# Altium project ps2-blueretro.PrjPcb
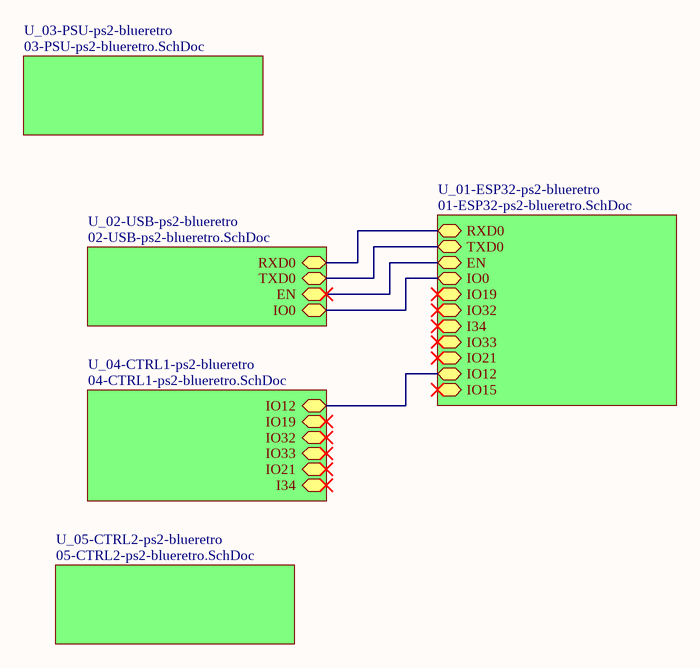
[diagram p0: 00-ps2-blueretro.SchDoc]
6 sheets, 58 parts. Net scope: hierarchical (ports join the sheet entries above them; power ports are global).
Board file: ps2-blueretro.PcbDoc
Sheets:
  00-ps2-blueretro.SchDoc
    U_03-PSU-ps2-blueretro = 03-PSU-ps2-blueretro.SchDoc
    U_01-ESP32-ps2-blueretro = 01-ESP32-ps2-blueretro.SchDoc
    U_02-USB-ps2-blueretro = 02-USB-ps2-blueretro.SchDoc
    U_04-CTRL1-ps2-blueretro = 04-CTRL1-ps2-blueretro.SchDoc
    U_05-CTRL2-ps2-blueretro = 05-CTRL2-ps2-blueretro.SchDoc

## Sheet 00-ps2-blueretro.SchDoc
size A; SheetNumber: 1; SheetTotal: 6

### Sub-sheets
U_01-ESP32-ps2-blueretro = 01-ESP32-ps2-blueretro.SchDoc: RXD0 (bidir), TXD0 (bidir), EN (bidir), IO0 (bidir), IO19 (bidir), IO32 (bidir), I34 (bidir), IO33 (bidir), IO21 (bidir), IO12 (bidir), IO15 (bidir)
U_02-USB-ps2-blueretro = 02-USB-ps2-blueretro.SchDoc: RXD0 (bidir), TXD0 (bidir), EN (bidir), IO0 (bidir)
U_03-PSU-ps2-blueretro = 03-PSU-ps2-blueretro.SchDoc: no entries
U_04-CTRL1-ps2-blueretro = 04-CTRL1-ps2-blueretro.SchDoc: IO19 (bidir), IO32 (bidir), IO33 (bidir), IO21 (bidir), I34 (bidir), IO12 (bidir)
U_05-CTRL2-ps2-blueretro = 05-CTRL2-ps2-blueretro.SchDoc: no entries

### Nets
NetC8_2: sheet U_01-ESP32-ps2-blueretro/EN, sheet U_02-USB-ps2-blueretro/EN
NetQ2_3: sheet U_01-ESP32-ps2-blueretro/IO0, sheet U_02-USB-ps2-blueretro/IO0
NetR8_1: sheet U_01-ESP32-ps2-blueretro/RXD0, sheet U_02-USB-ps2-blueretro/RXD0
NetR9_1: sheet U_01-ESP32-ps2-blueretro/TXD0, sheet U_02-USB-ps2-blueretro/TXD0
NetR18_2: sheet U_01-ESP32-ps2-blueretro/IO12, sheet U_04-CTRL1-ps2-blueretro/IO12

## Sheet 03-PSU-ps2-blueretro.SchDoc
size A; SheetNumber: 4; SheetTotal: 4
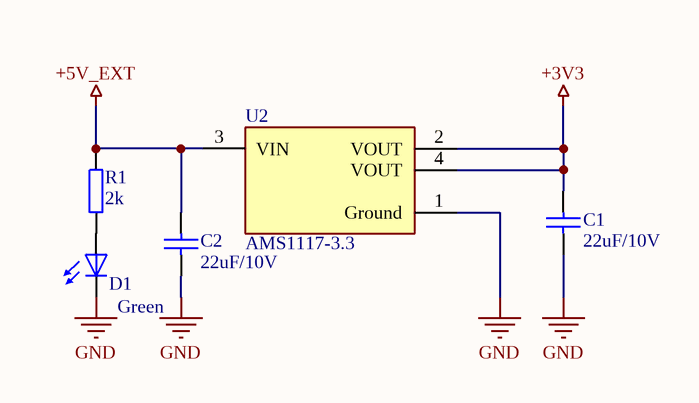
[diagram p1: 03-PSU-ps2-blueretro.SchDoc]

### Parts
C1  value 22uF/10V  [cap_0603]  (hidden comment: cap_0603)
C2  value 22uF/10V  [cap_0603]  (hidden comment: cap_0603)
D1  value Green  [led0603_GREEN]  (hidden comment: led_0603)
R1  value 2k  [res_0603]  (hidden comment: res_0603)
U2  AMS1117-3.3  [FP-AMS1117-IPC_C]

### Nets
+3V3: C1.2 U2.2(VOUT) U2.4(VOUT)
+5V_EXT: C2.2 R1.2 U2.3(VIN)
GND: C1.1 C2.1 D1.2(C) U2.1(Ground)
NetD1_1: D1.1(A) R1.1

### Library data of the parts
D1 = led_0603: Green 3,2V 20mA; Manufacturer: Würth Elektronik; Manufacturer Part Number: 150060GS75000; Supplier: Digikey; Price: 0,14; Supplier Part Number: 732-4971-1-ND; ComponentLink1Description: Supplier Link; ComponentLink1URL: https://www.digikey.at/de/products/detail/w%C3%BCrth-elektronik/150060GS75000/4489898; ComponentLink2Description: Manufacturer Link; ComponentLink2URL: *; ComponentLink3Description: Datasheet Link; ComponentLink3URL: https://www.we-online.com/components/products/datasheet/150060GS75000.pdf
U2 = CMP-209535-000001-1: LDO Voltage Regulators 1A, 3.3V; Manufacturer: Advanced Monolithic Systems; Dropout Voltage: 1.1V; Output Type: Fixed; Nominal Supply Current: 5mA; Max Power Dissipation: 1.2W; Max Supply Voltage: 15V; Number Of Outputs: 1; Standoff Height: 0.64mm; Max Junction Temp: +125°C; Height: 1.8mm; Package: AMS1117; Device Class L2: Power Management ICs; ComponentLink2Description: Datasheet; ComponentLink2URL: http://www.advanced-monolithic.com/pdf/ds1117.pdf; Category: IC; RoHS: TRUE; Automotive: No; Device Class L1: Integrated Circuits (ICs); Output Current: 1A; Device Class L3: Voltage Regulators - Linear; Temperature: -40°C to +125°C; Output Voltage: 3.3V; Manufacturer Part Number: AMS1117-3.3; Temperature Range Low: -40°C; Octopart: https://octopart.com/ams1117-3.3-advanced+monolithic+systems-25899300; Lead Free: Yes; Ipc Land Pattern Name: SOT229P700X180-4; Temperature Range High: +125°C

## Sheet 01-ESP32-ps2-blueretro.SchDoc
size A4; SheetNumber: 2; SheetTotal: 7
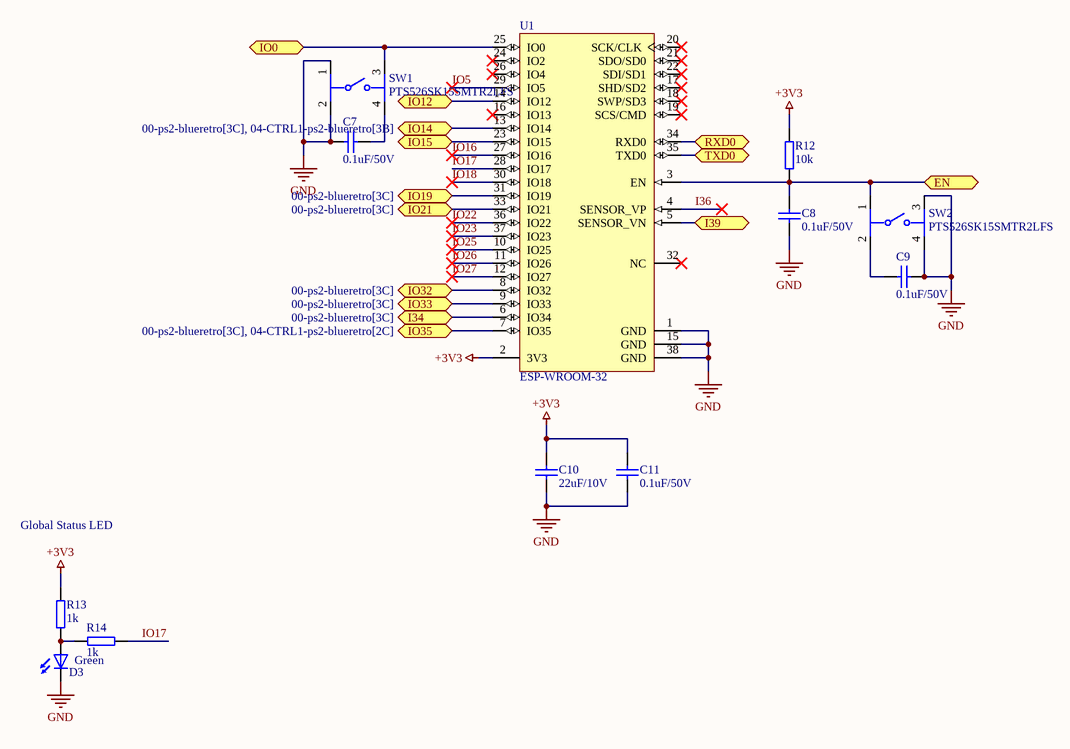
[diagram p2: 01-ESP32-ps2-blueretro.SchDoc]

### Parts
C7  value 0.1uF/50V  [cap_0603]  (hidden comment: cap_0603)
C8  value 0.1uF/50V  [cap_0603]  (hidden comment: cap_0603)
C9  value 0.1uF/50V  [cap_0603]  (hidden comment: cap_0603)
C10  value 22uF/10V  [cap_0603]  (hidden comment: cap_0603)
C11  value 0.1uF/50V  [cap_0603]  (hidden comment: cap_0603)
D3  value Green  [led0603_GREEN]  (hidden comment: led_0603)
R12  value 10k  [res_0603]  (hidden comment: res_0603)
R13  value 1k  [res_0603]  (hidden comment: res_0603)
R14  value 1k  [res_0603]  (hidden comment: res_0603)
SW1  PTS526SK15SMTR2LFS  [FP-PTS526SK15SMTR2LFS-MFG]
SW2  PTS526SK15SMTR2LFS  [FP-PTS526SK15SMTR2LFS-MFG]
U1  ESP-WROOM-32  [OLMX-ESP-WROOM-32]

### Ports
EN (bidir, see 00-ps2-blueretro[3B], 02-USB-ps2-blueretro[4A]), I34 (bidir, see 00-ps2-blueretro[3C]), I39 (bidir), IO0 (bidir, see 00-ps2-blueretro[3C], 02-USB-ps2-blueretro[4B]), IO12 (bidir, see 00-ps2-blueretro[3C], 04-CTRL1-ps2-blueretro[3B]), IO14 (bidir, see 00-ps2-blueretro[3C], 04-CTRL1-ps2-blueretro[3B]), IO15 (bidir, see 00-ps2-blueretro[3C]), IO19 (bidir, see 00-ps2-blueretro[3C]), IO21 (bidir, see 00-ps2-blueretro[3C]), IO32 (bidir, see 00-ps2-blueretro[3C]), IO33 (bidir, see 00-ps2-blueretro[3C]), IO35 (bidir, see 00-ps2-blueretro[3C], 04-CTRL1-ps2-blueretro[2C]), RXD0 (bidir, see 00-ps2-blueretro[3B], 02-USB-ps2-blueretro[4C]), TXD0 (bidir, see 00-ps2-blueretro[3B], 02-USB-ps2-blueretro[4C])

### Nets
+3V3: C10.2 C11.2 R12.1 R13.2 U1.2(3V3)
GND: C7.2 C8.1 C9.2 C10.1 C11.1 D3.2(C) SW1.1 SW1.2 SW2.3 SW2.4 U1.1(GND) U1.15(GND) U1.38(GND)
I36: U1.4(SENSOR_VP)
IO5: U1.29(IO5)
IO16: U1.27(IO16)
IO17: R14.1 U1.28(IO17)
IO18: U1.30(IO18)
IO22: U1.36(IO22)
IO23: U1.37(IO23)
IO25: U1.10(IO25)
IO26: U1.11(IO26)
IO27: U1.12(IO27)
NetC7_1: C7.1 SW1.4
NetC8_2: C8.2 R12.2 SW2.1 U1.3(EN) ; port EN
NetC9_1: C9.1 SW2.2
NetD3_1: D3.1(A) R13.1 R14.2
NetQ2_3: SW1.3 U1.25(IO0) ; port IO0
NetR8_1: U1.34(RXD0) ; port RXD0
NetR9_1: U1.35(TXD0) ; port TXD0
NetR18_2: U1.14(IO12) ; port IO12
NetU1_5: U1.5(SENSOR_VN) ; port I39
NetU1_6: U1.6(IO34) ; port I34
NetU1_7: U1.7(IO35) ; port IO35
NetU1_8: U1.8(IO32) ; port IO32
NetU1_9: U1.9(IO33) ; port IO33
NetU1_13: U1.13(IO14) ; port IO14
NetU1_23: U1.23(IO15) ; port IO15
NetU1_31: U1.31(IO19) ; port IO19
NetU1_33: U1.33(IO21) ; port IO21

Not connected (* = marked no-connect by the designer): U1 16(IO13)* 17(SHD/SD2)* 18(SWP/SD3)* 19(SCS/CMD)* 20(SCK/CLK)* 21(SDO/SD0)* 22(SDI/SD1)* 24(IO2)* 26(IO4)* 32(NC)*

### Notes on the sheet
- Global Status LED

### Library data of the parts
D3 = led_0603: as D1 on sheet 03-PSU-ps2-blueretro; Supplier: Digikey; Price: 0,14; Supplier Part Number: 732-4971-1-ND; ComponentLink1Description: Supplier Link; ComponentLink1URL: https://www.digikey.at/de/products/detail/w%C3%BCrth-elektronik/150060GS75000/4489898; ComponentLink2Description: Manufacturer Link; ComponentLink2URL: *; ComponentLink3Description: Datasheet Link; ComponentLink3URL: https://www.we-online.com/components/products/datasheet/150060GS75000.pdf
SW1 SW2 = CMP-10040-000013-1: TACT 5.2 X 5.2, 1.5 MM H, 260GF,; Manufacturer: C&K; Operating Force: 250gf; Throw Configuration: SPST-NO; Contact Current Rating: 50mA; Standoff Height: 0mm; Contact Resistance: 100mΩ; Voltage Rating Dc: 12V; Electromechanical Life: 200000Cycles; Device Class L3: Tactile Switches; Device Class L2: Switches; Temperature: -20°C to +70°C; Temperature Range Low: -20°C; Package: PTS526SK15SMTR2LFS; Temperature Range High: +70°C; ComponentLink2Description: Datasheet; Device Class L1: Electromechanical; Height: 1.65mm; Digikey Description: TACT 5.2 X 5.2, 1.5 MM H, 260GF,; Category: Switch; RoHS: TRUE; Automotive: No; Lead Free: Yes; Manufacturer Part Number: PTS526SK15SMTR2LFS; Octopart: https://octopart.com/pts526+sk15+smtr2+lfs-c%26k+components-100617999; ComponentLink2URL: https://www.ckswitches.com/media/2780/pts526.pdf
U1 = CMP-2000-07454-1: Espressif System, 2.7 to 3.6 V, -40 to 85 degC, 38-Pin SMD; Manufacturer: Olimex; Package Description: 38-Pin Surface Mount Device, Body 18 x 25.5 mm, Pitch 1.27 mm; Manufacturer URL: https://www.olimex.com; RoHSCompliant: false; Mounting Technology: SurfaceMount; Datasheet Version: Rev. 2.1, 09/2017; Datasheet URL: http://www.espressif.com/sites/default/files/documentation/esp-wroom-32_datasheet_en.pdf; Package Reference: ESP-WROOM-32

## Sheet 02-USB-ps2-blueretro.SchDoc
size A; SheetNumber: 3; SheetTotal: 4
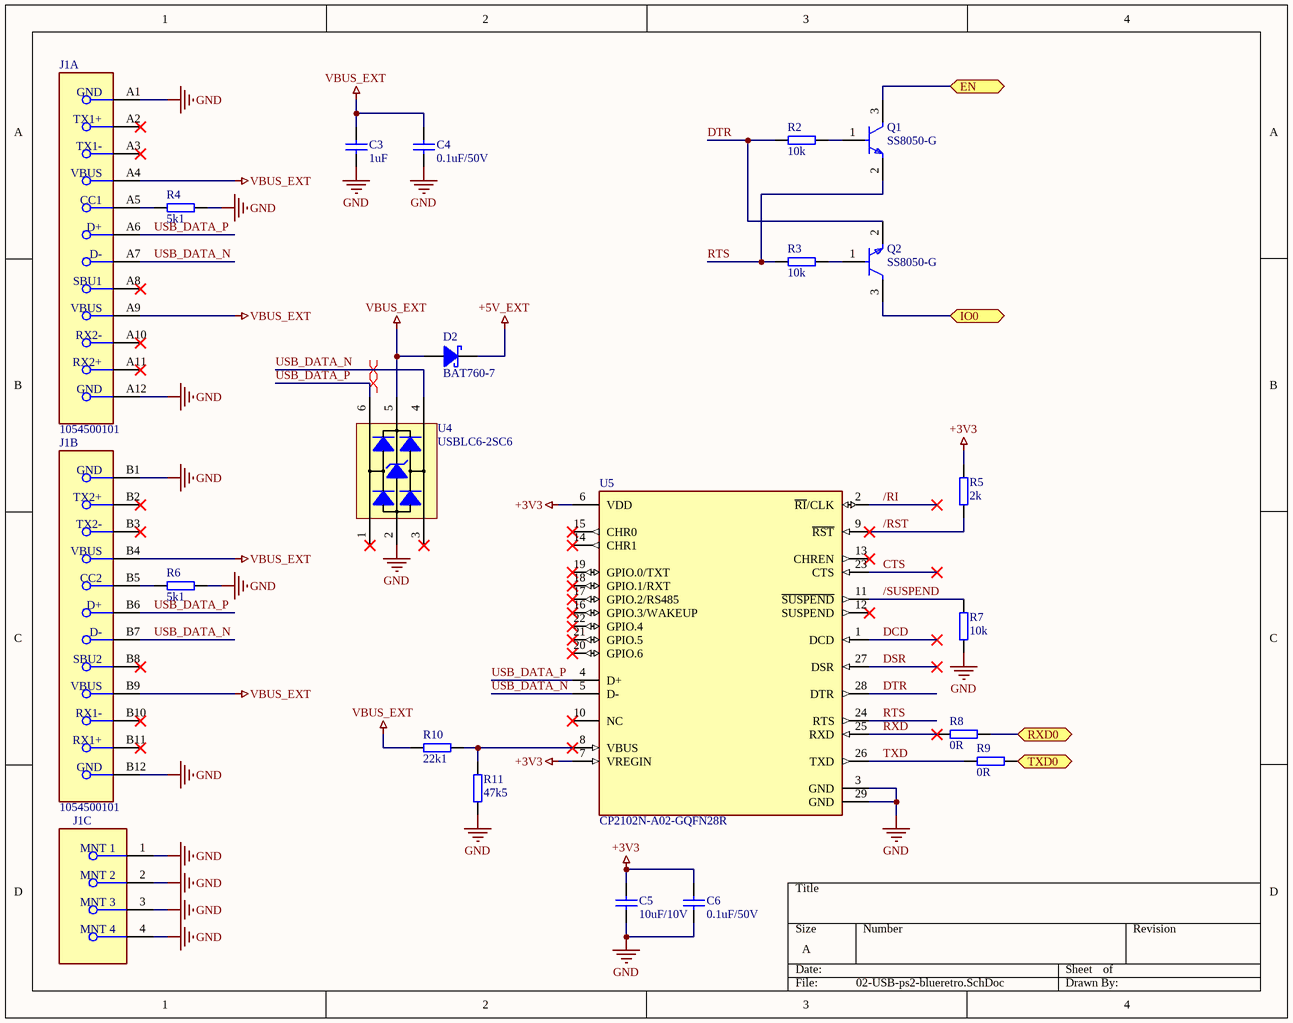
[diagram p3: 02-USB-ps2-blueretro.SchDoc]

### Parts
C3  value 1uF  [cap_0603]  (hidden comment: cap_0603)
C4  value 0.1uF/50V  [cap_0603]  (hidden comment: cap_0603)
C5  value 10uF/10V  [cap_0603]  (hidden comment: cap_0603)
C6  value 0.1uF/50V  [cap_0603]  (hidden comment: cap_0603)
D2  BAT760-7  [sod-323]
J1  1054500101  [FP-1054500101-MFG]  (parts A,B,C of 3)
Q1  SS8050-G  [FP-SS8050-G-MFG]
Q2  SS8050-G  [FP-SS8050-G-MFG]
R2  value 10k  [res_0603]  (hidden comment: res_0603)
R3  value 10k  [res_0603]  (hidden comment: res_0603)
R4  value 5k1  [res_0603]  (hidden comment: res_0603)
R5  value 2k  [res_0603]  (hidden comment: res_0603)
R6  value 5k1  [res_0603]  (hidden comment: res_0603)
R7  value 10k  [res_0603]  (hidden comment: res_0603)
R8  value 0R  [res_0603]  (hidden comment: res_0603)
R9  value 0R  [res_0603]  (hidden comment: res_0603)
R10  value 22k1  [res_0603]  (hidden comment: res_0603)
R11  value 47k5  [res_0603]  (hidden comment: res_0603)
U4  USBLC6-2SC6  [sot23-6l]
U5  CP2102N-A02-GQFN28R  [FP-CP2102N-A02-GQFN28R-MFG]

### Ports
EN (bidir, see 00-ps2-blueretro[2B], 01-ESP32-ps2-blueretro[3B]), IO0 (bidir, see 00-ps2-blueretro[2C], 01-ESP32-ps2-blueretro[1B]), RXD0 (bidir, see 00-ps2-blueretro[2B], 01-ESP32-ps2-blueretro[2B]), TXD0 (bidir, see 00-ps2-blueretro[2B], 01-ESP32-ps2-blueretro[2B])

### Nets
+3V3: C5.2 C6.2 R5.1 U5.6(VDD) U5.7(VREGIN)
+5V_EXT: D2.1(K)
GND: C3.1 C4.1 C5.1 C6.1 J1.1(MNT_1) J1.2(MNT_2) J1.3(MNT_3) J1.4(MNT_4) J1.A1(GND) J1.A12(GND) J1.B1(GND) J1.B12(GND) R4.1 R6.1 R7.2 R11.2 U4.2 U5.3(GND) U5.29(GND)
VBUS_EXT: C3.2 C4.2 D2.2(A) J1.A4(VBUS) J1.A9(VBUS) J1.B4(VBUS) J1.B9(VBUS) R10.2 U4.5
/RI: U5.2(~{RI}/CLK)
/RST: R5.2 U5.9(~{RST})
/SUSPEND: R7.1 U5.11(~{SUSPEND})
CTS: U5.23(CTS)
DCD: U5.1(DCD)
DSR: U5.27(DSR)
DTR: Q2.2(E) R2.1 U5.28(DTR)
RTS: Q1.2(E) R3.1 U5.24(RTS)
RXD: R8.2 U5.25(RXD)
TXD: R9.2 U5.26(TXD)
USB_DATA_N: J1.A7(D-) J1.B7(D-) U4.4 U5.5(D-)
USB_DATA_P: J1.A6(D+) J1.B6(D+) U4.6 U5.4(D+)
NetC8_2: Q1.3(C) ; port EN
NetJ1_A5: J1.A5(CC1) R4.2
NetJ1_B5: J1.B5(CC2) R6.2
NetQ1_1: Q1.1(B) R2.2
NetQ2_1: Q2.1(B) R3.2
NetQ2_3: Q2.3(C) ; port IO0
NetR8_1: R8.1 ; port RXD0
NetR9_1: R9.1 ; port TXD0
NetR10_1: R10.1 R11.1 U5.8(VBUS)

Not connected (* = marked no-connect by the designer): J1 A2(TX1+)* A3(TX1-)* A8(SBU1)* A10(RX2-)* A11(RX2+)* B2(TX2+)* B3(TX2-)* B8(SBU2)* B10(RX1-)* B11(RX1+)*; U4 1* 3*; U5 10(NC)* 12(SUSPEND)* 13(CHREN)* 14(CHR1)* 15(CHR0)* 16(GPIO.3/WAKEUP)* 17(GPIO.2/RS485)* 18(GPIO.1/RXT)* 19(GPIO.0/TXT)* 20(GPIO.6)* 21(GPIO.5)* 22(GPIO.4)*

### Layout directives
differential pair: USB_DATA_N, USB_DATA_P

### Library data of the parts
D2 = BAT760-7: 30V 1A, Vf=495mV @ 1A, Ir=50µA @ 15V Schottky Diode; Manufacturer: Diodes Incorporated; Supplier: Digikey; Price: 0,48; Manufacturer Part Number: BAT760-7; Supplier Part Number: BAT760DICT-ND; ComponentLink1Description: Supplier Link; ComponentLink1URL: https://www.digikey.at/de/products/detail/diodes-incorporated/BAT760-7/697106; ComponentLink2Description: Manufacturer Link; ComponentLink2URL: *; ComponentLink3Description: Datasheet Link; ComponentLink3URL: https://www.diodes.com/assets/Datasheets/BAT760.pdf
J1 = CMP-04767-000004-1: CONN RCP USB3.1 TYPEC 24P SMD RA; Manufacturer: Molex; Number Of Contacts: 24; Voltage Rating: 30V; Shielding: true; Is Female: yes; Current Rating: 0.25/1.25/5A; Pitch: 0.5mm; Conn Orientation: Right Angle; Package: 0; Height: 3.44mm; Footprint Url: https://www.molex.com/pdm_docs/sd/1054500101_sd.pdf; Device Class L1: Connectors; Category: Conn; Device Class L2: USB Connectors; Digikey Description: CONN RCP USB3.1 TYPEC 24P SMD RA; Contact Material: Gold,Nickel; Mouser Description: USB Shielded I/O Receptacle; Type C; Right Angle; Surface Mount; Gold over Nickel; ComponentLink2Description: Datasheet; Lead Free: Yes; Automotive: No; Temperature Range High: +85°C; RoHS: TRUE; Octopart: https://octopart.com/105450-0101-molex-68082325; ComponentLink2URL: https://www.molex.com/webdocs/datasheets/pdf/en-us/1054500101_IO_CONNECTORS.pdf; Temperature: -30°C to +85°C; Usb Standard: USB 3.1; Temperature Range Low: -30°C; Device Class L3: unset; Manufacturer Part Number: 1054500101
Q1 Q2 = CMP-20235-000001-1: NPN TRANSISTOR 1.5A 40V SOT-23 R; Transition Frequency: 100MHz; Max Breakdown Voltage: 25V; Collector Emitter Voltage (VCEO): 400mV; Max Power Dissipation: 300mW; Max Collector Current: 1.5A; Case/Package: TO-236-3; Packaging: Tape and Reel; RoHS Compliant: Yes; Mount: Surface Mount; Collector Emitter Breakdown Voltage: 25V
U4 = USBLC6-2SC6: 2.5V 5A, Vf=1.1V @ 10mA, Ir=6µA @ 2.5V ESD Protection Diode; Manufacturer: STMicroelectronics; Supplier: Digikey; Price: 0,32; Manufacturer Part Number: USBLC6-2SC6; Supplier Part Number: 497-5235-1-ND; ComponentLink1Description: Supplier Link; ComponentLink1URL: https://www.digikey.at/de/products/detail/stmicroelectronics/USBLC6-2SC6/1040559; ComponentLink2Description: Manufacturer Link; ComponentLink2URL: *; ComponentLink3Description: Datasheet Link; ComponentLink3URL: https://www.st.com/content/ccc/resource/technical/document/datasheet/06/1d/48/9c/6c/20/4a/b2/CD00050750.pdf/files/CD00050750.pdf/jcr:content/translations/en.CD00050750.pdf
U5 = CMP-08093-000007-1: IC USB TO UART BRIDGE QFN28

## Sheet 04-CTRL1-ps2-blueretro.SchDoc
size A; SheetNumber: 5; SheetTotal: 6
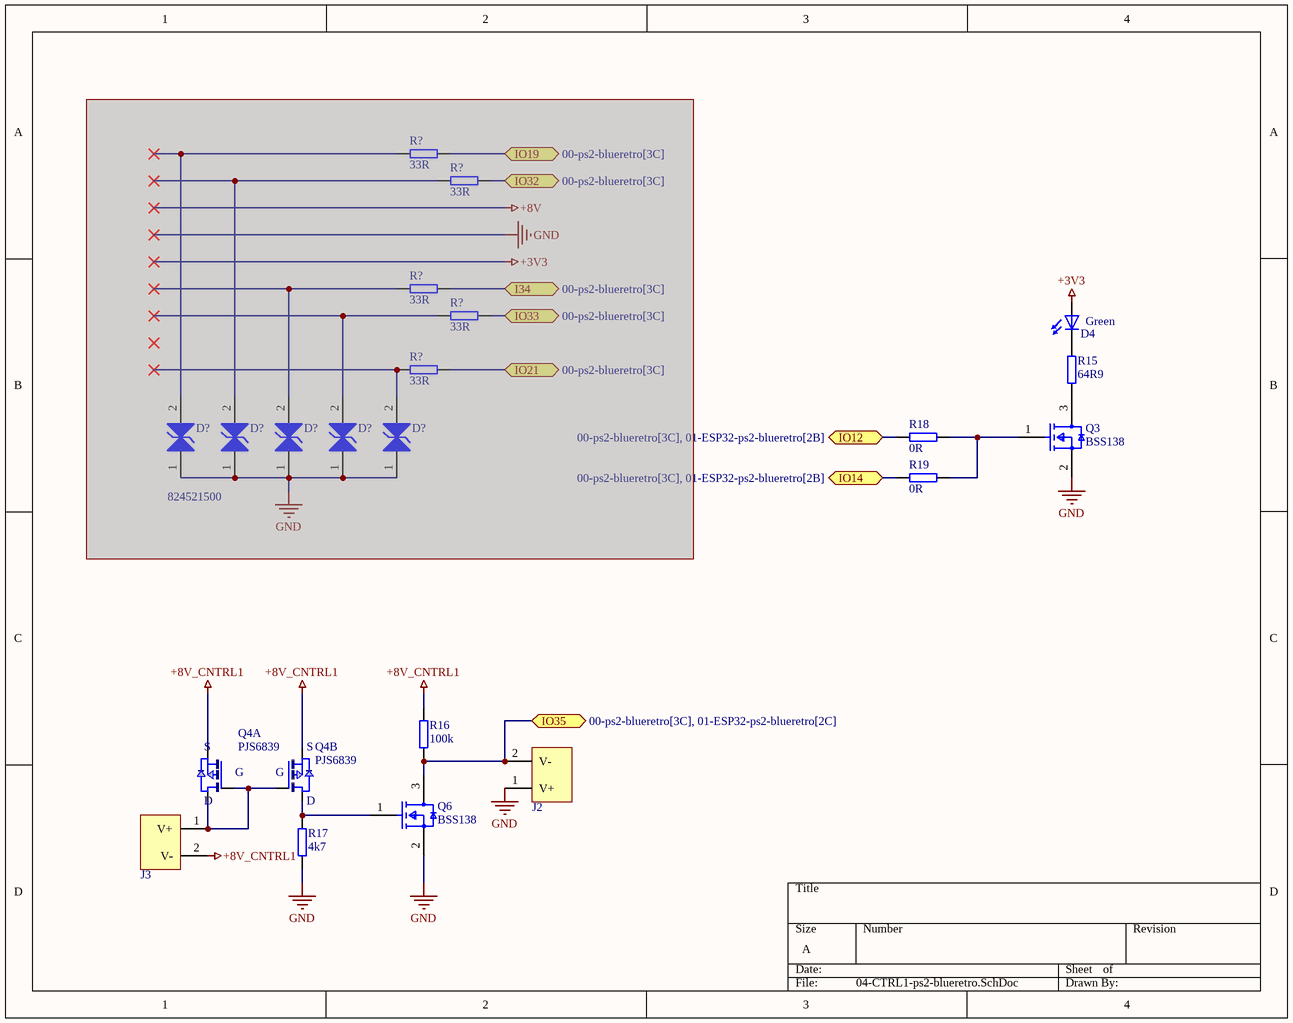
[diagram p4: 04-CTRL1-ps2-blueretro.SchDoc]

### Parts
(Parts that share a designator on the sheet are numbered #1, #2 ... from top to bottom, then left to right.)
D4  value Green  [led0603_GREEN]  (hidden comment: led_0603)
D?#1  824521500  [WE-TVSP_DO-214AA_Bidirectional]  (masked out: inside a compile mask, not in the netlist)
D?#2  824521500  [WE-TVSP_DO-214AA_Bidirectional]  (value not drawn)  (masked out: inside a compile mask, not in the netlist)
D?#3  824521500  [WE-TVSP_DO-214AA_Bidirectional]  (value not drawn)  (masked out: inside a compile mask, not in the netlist)
D?#4  824521500  [WE-TVSP_DO-214AA_Bidirectional]  (value not drawn)  (masked out: inside a compile mask, not in the netlist)
D?#5  824521500  [WE-TVSP_DO-214AA_Bidirectional]  (value not drawn)  (masked out: inside a compile mask, not in the netlist)
J2  2 Pole 2.54mm  [2.54mm_2pole]  (value not drawn)  (no BOM)
J3  2 Pole 2.54mm  [2.54mm_2pole]  (value not drawn)  (no BOM)
Q3  BSS138  [FP-318-08-IPC_B]
Q4  PJS6839  [SOT23-6]  (parts A,B of 2)
Q6  BSS138  [FP-318-08-IPC_B]
R15  value 64R9  [res_0603]  (hidden comment: res_0603)
R16  value 100k  [res_0603]  (hidden comment: res_0603)
R17  value 4k7  [res_0603]  (hidden comment: res_0603)
R18  value 0R  [res_0603]  (hidden comment: res_0603)
R19  value 0R  [res_0603]  (hidden comment: res_0603)
R?#1  value 33R  [res_0603]  (hidden comment: res_0603)  (masked out: inside a compile mask, not in the netlist)
R?#2  value 33R  [res_0603]  (hidden comment: res_0603)  (masked out: inside a compile mask, not in the netlist)
R?#3  value 33R  [res_0603]  (hidden comment: res_0603)  (masked out: inside a compile mask, not in the netlist)
R?#4  value 33R  [res_0603]  (hidden comment: res_0603)  (masked out: inside a compile mask, not in the netlist)
R?#5  value 33R  [res_0603]  (hidden comment: res_0603)  (masked out: inside a compile mask, not in the netlist)

### Ports
I34 (bidir, see 00-ps2-blueretro[3C]), IO12 (bidir, see 00-ps2-blueretro[3C], 01-ESP32-ps2-blueretro[2B]), IO14 (bidir, see 00-ps2-blueretro[3C], 01-ESP32-ps2-blueretro[2B]), IO19 (bidir, see 00-ps2-blueretro[3C]), IO21 (bidir, see 00-ps2-blueretro[3C]), IO32 (bidir, see 00-ps2-blueretro[3C]), IO33 (bidir, see 00-ps2-blueretro[3C]), IO35 (bidir, see 00-ps2-blueretro[3C], 01-ESP32-ps2-blueretro[2C])

### Nets
+3V3: D4.1(A)
+8V_CNTRL1: J3.2(V-) Q4.2(S2) Q4.5(S1) R16.2
GND: J2.1(V+) Q3.2(S) Q6.2(S) R17.1
NetD4_2: D4.2(C) R15.2
NetJ2_2: J2.2(V-) Q6.3(D) R16.1 ; port IO35
NetJ3_1: J3.1(V+) Q4.1(G1) Q4.3(G2) Q4.6(D1)
NetQ3_1: Q3.1(G) R18.1 R19.1
NetQ3_3: Q3.3(D) R15.1
NetQ4_4: Q4.4(D2) Q6.1(G) R17.2
NetR18_2: R18.2 ; port IO12
NetR19_2: R19.2 ; port IO14

### Notes on the sheet
- (in symbol PJS6839, part A) S; G; D
- (in symbol PJS6839, part B) S; G; D

### Library data of the parts
D4 = led_0603: as D1 on sheet 03-PSU-ps2-blueretro; Supplier: Digikey; Price: 0,14; Supplier Part Number: 732-4971-1-ND; ComponentLink1Description: Supplier Link; ComponentLink1URL: https://www.digikey.at/de/products/detail/w%C3%BCrth-elektronik/150060GS75000/4489898; ComponentLink2Description: Manufacturer Link; ComponentLink2URL: *; ComponentLink3Description: Datasheet Link; ComponentLink3URL: https://www.we-online.com/components/products/datasheet/150060GS75000.pdf
D?#1-D?#5 = CMP-03913-71101632-1: 824521500 Tvs Diode, 600W, 5V, Bidir, DO-214AA; Leakage Current: 1.6mA; Clamping Voltage: 9.2V; Max Breakdown Voltage: 6.7V; Power Line Protection: No; Peak Pulse Current: 65.3A; Number of Bidirectional Channels: 1; Polarity: Bidirectional; Length: 4.32mm; Reverse Standoff Voltage: 5V; Number of Pins: 2; Peak Pulse Power: 600W; Height: 2.4mm; Width: 3.62mm; Min Operating Temperature: -65°C; REACH SVHC: Unknown; Breakdown Voltage: 6.7V; Min Breakdown Voltage: 6.7V; Max Operating Temperature: 150°C; Composition: Zener; Packaging: Cut Tape; NexarPartId: 71101632; Mount: Surface Mount; RoHS: Compliant
J2 J3 = 2 Pole 2.54mm: Solder contacts for a 2.54mm connector
Q3 Q6 = CMP-07173-000101-1: MOSFET N-CH 50V 220MA SOT-23; Turn-Off Delay Time: 20ns; Element Configuration: Single; Rds On Max: 3.5R; Gate to Source Voltage (Vgs): 20V; Threshold Voltage: 1.3V; Number of Elements: 1; Power Dissipation: 360mW; Rise Time: 9ns; Turn-On Delay Time: 2.5ns; Input Capacitance: 27pF; On-State Resistance: 6R; Lead Free: Lead Free; Length: 2.92mm; Width: 1.3mm; Drain to Source Breakdown Voltage: 50V; Min Operating Temperature: -55°C; REACH SVHC: No SVHC; Packaging: Tape and Reel; Radiation Hardening: No; Height: 0.93mm; Drain to Source Voltage (Vdss): 50V; Current Rating: 220mA; Voltage Rating (DC): 50V; Weight: 0.03g; Continuous Drain Current (ID): 220mA; Number of Pins: 3; Nominal Vgs: 1.3V; Max Power Dissipation: 360mW; Fall Time: 9ns; Drain to Source Resistance: 3.5R; Contact Plating: Tin; Case/Package: SOT-23; Package Quantity: 1; Dual Supply Voltage: 50V; Mount: Surface Mount; Termination: SMD/SMT; Max Operating Temperature: 150°C
Q4 = PJS6839: MOSFET P-CH 60V 300mA SOT-23-6; Manufacturer: Panjit International Inc.; Manufacturer Part Number: PJS6839_S1_00001; Supplier: Digikey; Supplier Part Number: 3757-PJS6839_S1_00001CT-ND; Price: 0.28; ComponentLink1Description: Datasheet; ComponentLink1URL: https://www.panjit.com.tw/upload/datasheet/PJS6839.pdf; ComponentLink2Description: Supplier; ComponentLink2URL: https://www.digikey.at/en/products/detail/panjit-international-inc/PJS6839-S1-00001/15799236; Value: PJS6839

## Sheet 05-CTRL2-ps2-blueretro.SchDoc
size A; SheetNumber: 6; SheetTotal: 6

## Nets that join several sheets
+3V3: 03-PSU-ps2-blueretro (C1.2 U2.2 U2.4), 01-ESP32-ps2-blueretro (5 pins), 02-USB-ps2-blueretro (5 pins), 04-CTRL1-ps2-blueretro (D4.1)
+5V_EXT: 03-PSU-ps2-blueretro (C2.2 R1.2 U2.3), 02-USB-ps2-blueretro (D2.1)
GND: 03-PSU-ps2-blueretro (C1.1 C2.1 D1.2 U2.1), 01-ESP32-ps2-blueretro (13 pins), 02-USB-ps2-blueretro (19 pins), 04-CTRL1-ps2-blueretro (J2.1 Q3.2 Q6.2 R17.1)
NetC8_2: 01-ESP32-ps2-blueretro (C8.2 R12.2 SW2.1 U1.3), 02-USB-ps2-blueretro (Q1.3)
NetQ2_3: 01-ESP32-ps2-blueretro (SW1.3 U1.25), 02-USB-ps2-blueretro (Q2.3)
NetR8_1: 01-ESP32-ps2-blueretro (U1.34), 02-USB-ps2-blueretro (R8.1)
NetR9_1: 01-ESP32-ps2-blueretro (U1.35), 02-USB-ps2-blueretro (R9.1)
NetR18_2: 01-ESP32-ps2-blueretro (U1.14), 04-CTRL1-ps2-blueretro (R18.2)